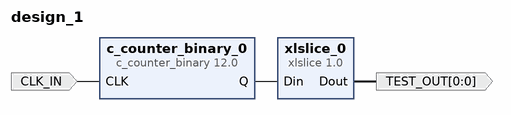
[diagram p0: block diagram of the top level]
# Vivado block design design_1, xc7z020clg484-1, Vivado 2024.2
create_bd_design design_1

create_bd_port -dir I -type clk CLK_IN
set_property -dict {CONFIG.FREQ_HZ 10000000} [get_bd_ports CLK_IN]
create_bd_port -dir O -from 0 -to 0 TEST_OUT

create_bd_cell -type ip -vlnv xilinx.com:ip:c_counter_binary:12.0 c_counter_binary_0
set_property -dict {CONFIG.Output_Width 27} [get_bd_cells c_counter_binary_0]
create_bd_cell -type ip -vlnv xilinx.com:ip:xlslice:1.0 xlslice_0
set_property -dict {CONFIG.DIN_FROM 10 CONFIG.DIN_TO 10 CONFIG.DIN_WIDTH 27} [get_bd_cells xlslice_0]

# ---- connections ----

connect_bd_net -net CLK_0_1 [get_bd_ports CLK_IN] [get_bd_pins c_counter_binary_0/CLK]
connect_bd_net [get_bd_pins c_counter_binary_0/Q] [get_bd_pins xlslice_0/Din]
connect_bd_net [get_bd_pins xlslice_0/Dout] [get_bd_ports TEST_OUT]

validate_bd_design
save_bd_design
